# EAGLE board OpenROV Controller 2.6 (EAGLE 6.4)
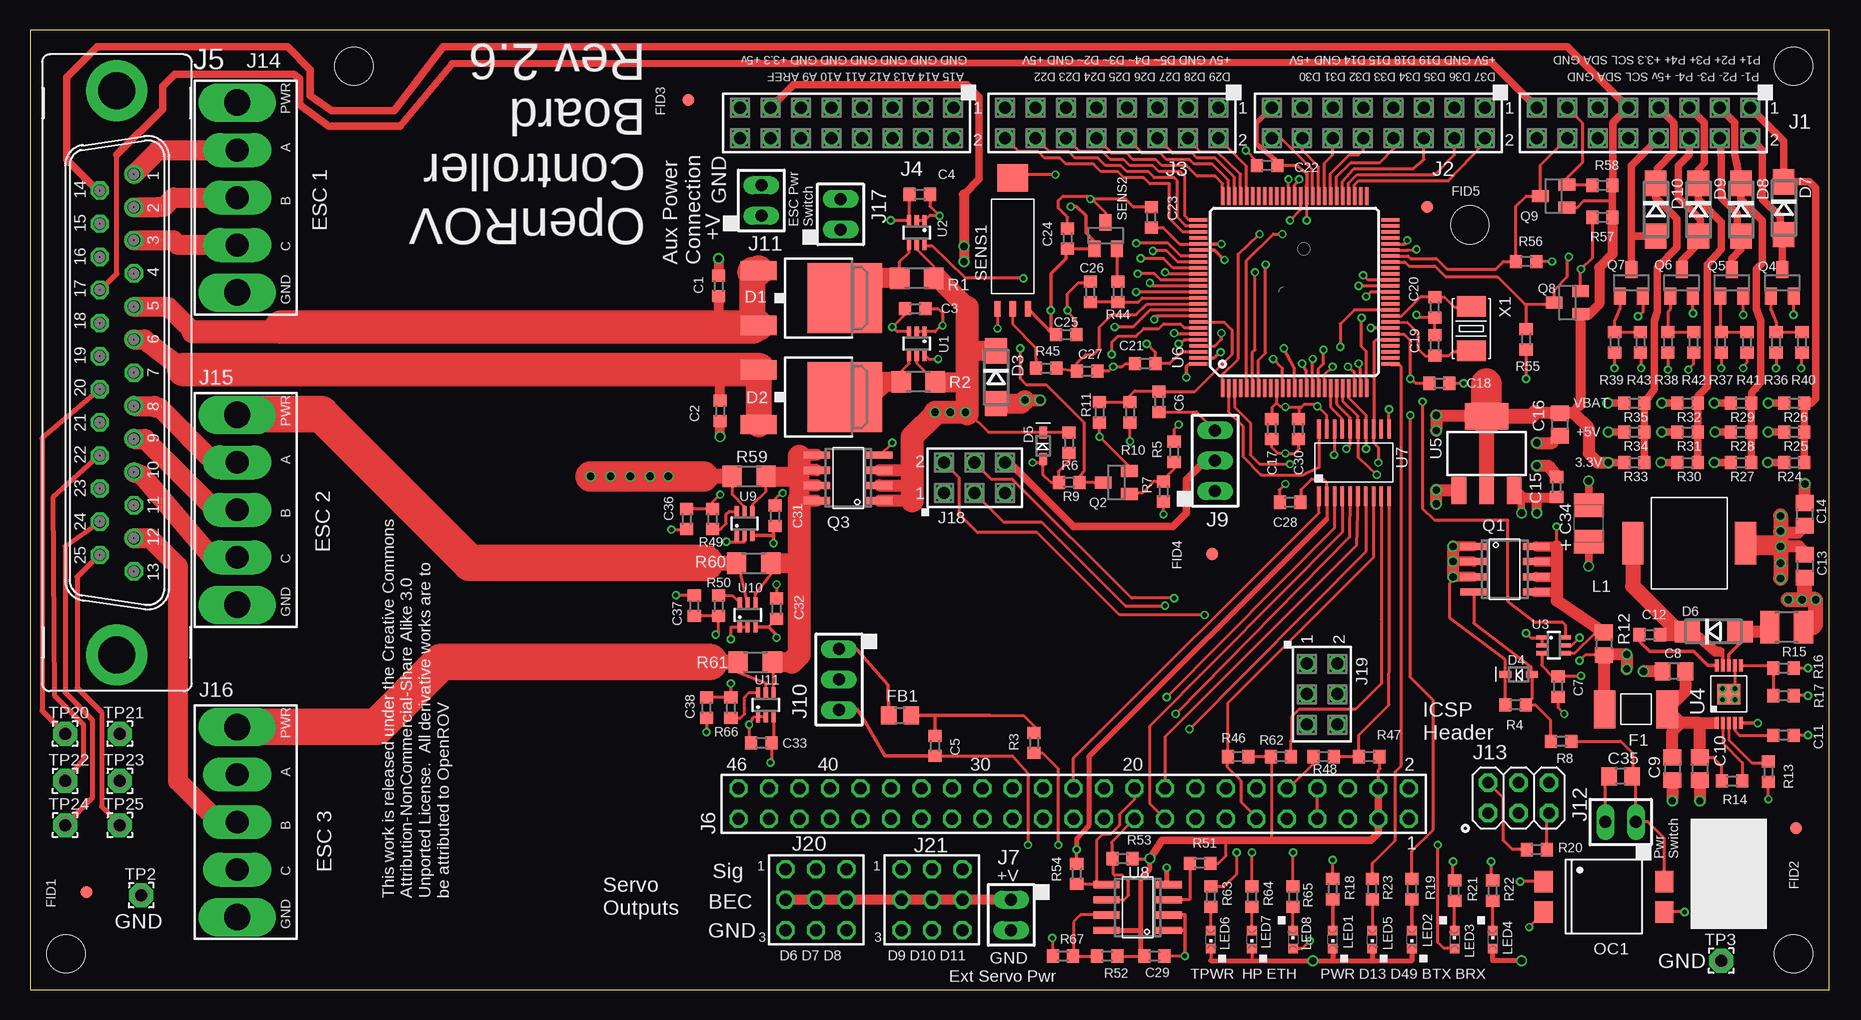
[diagram p8: board, top side]
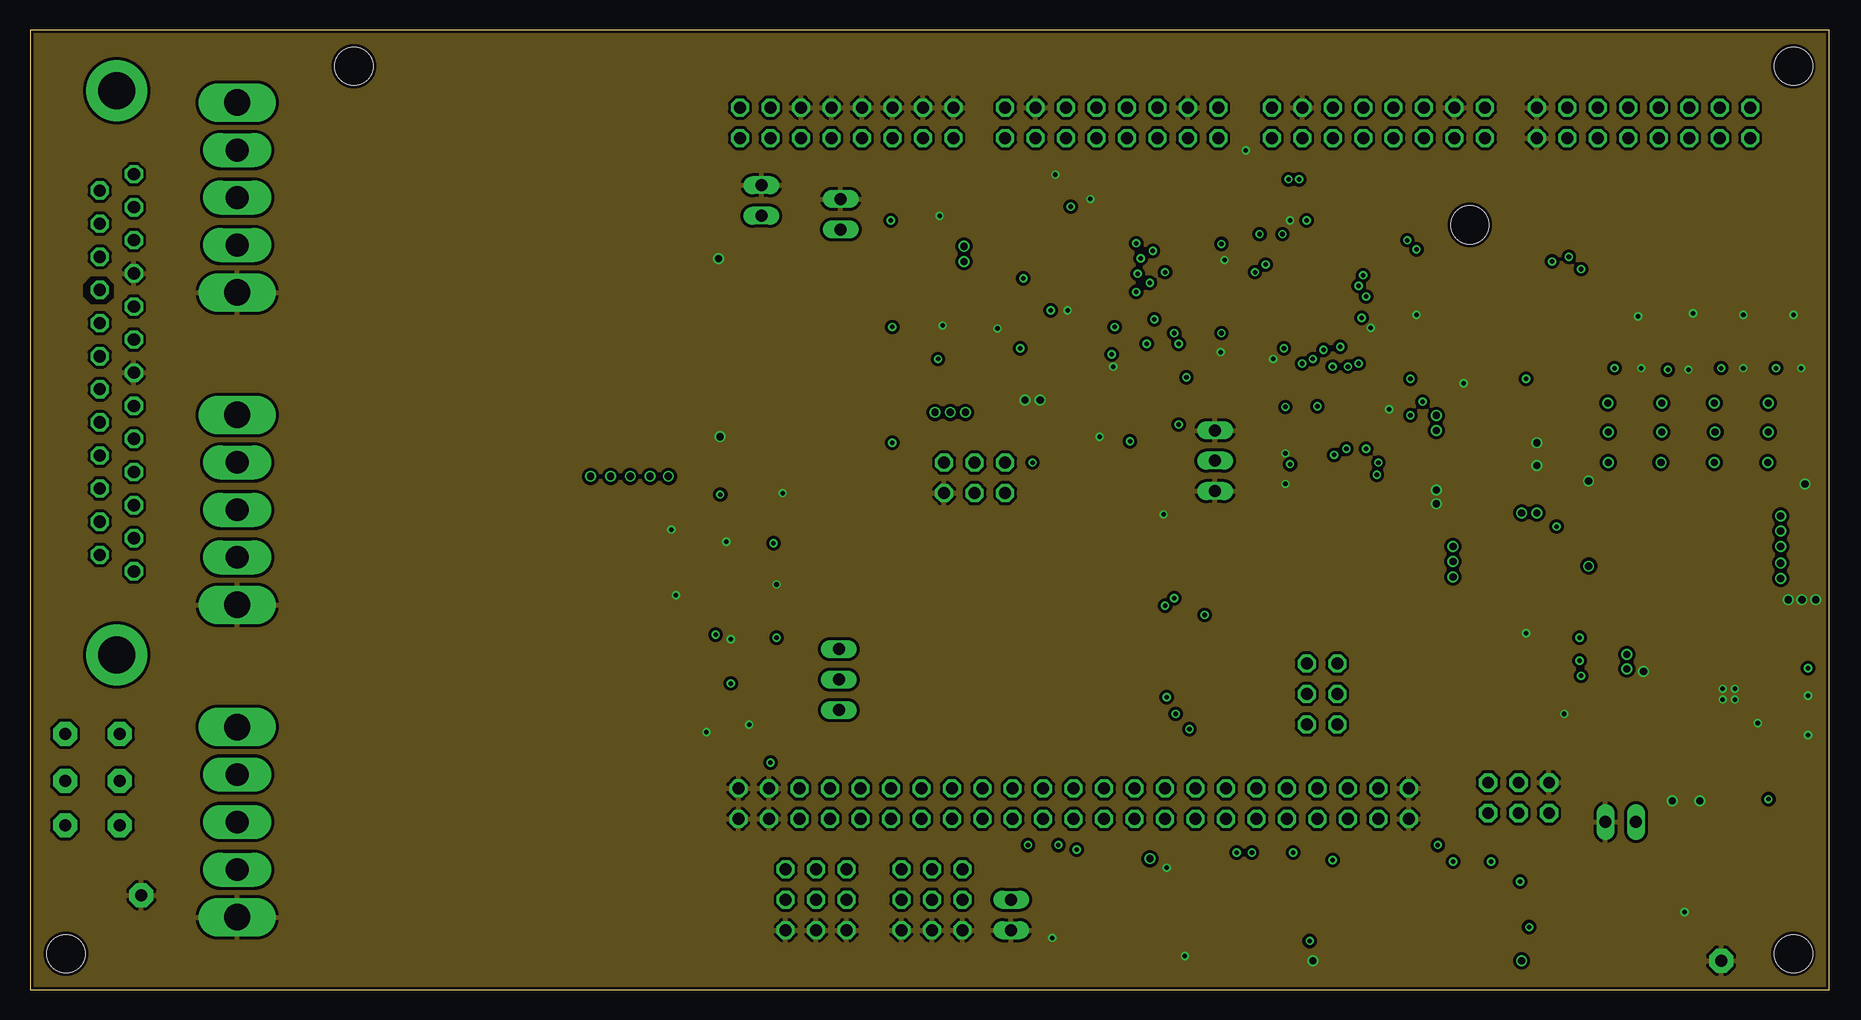
[diagram p9: board, inner layer Route2]
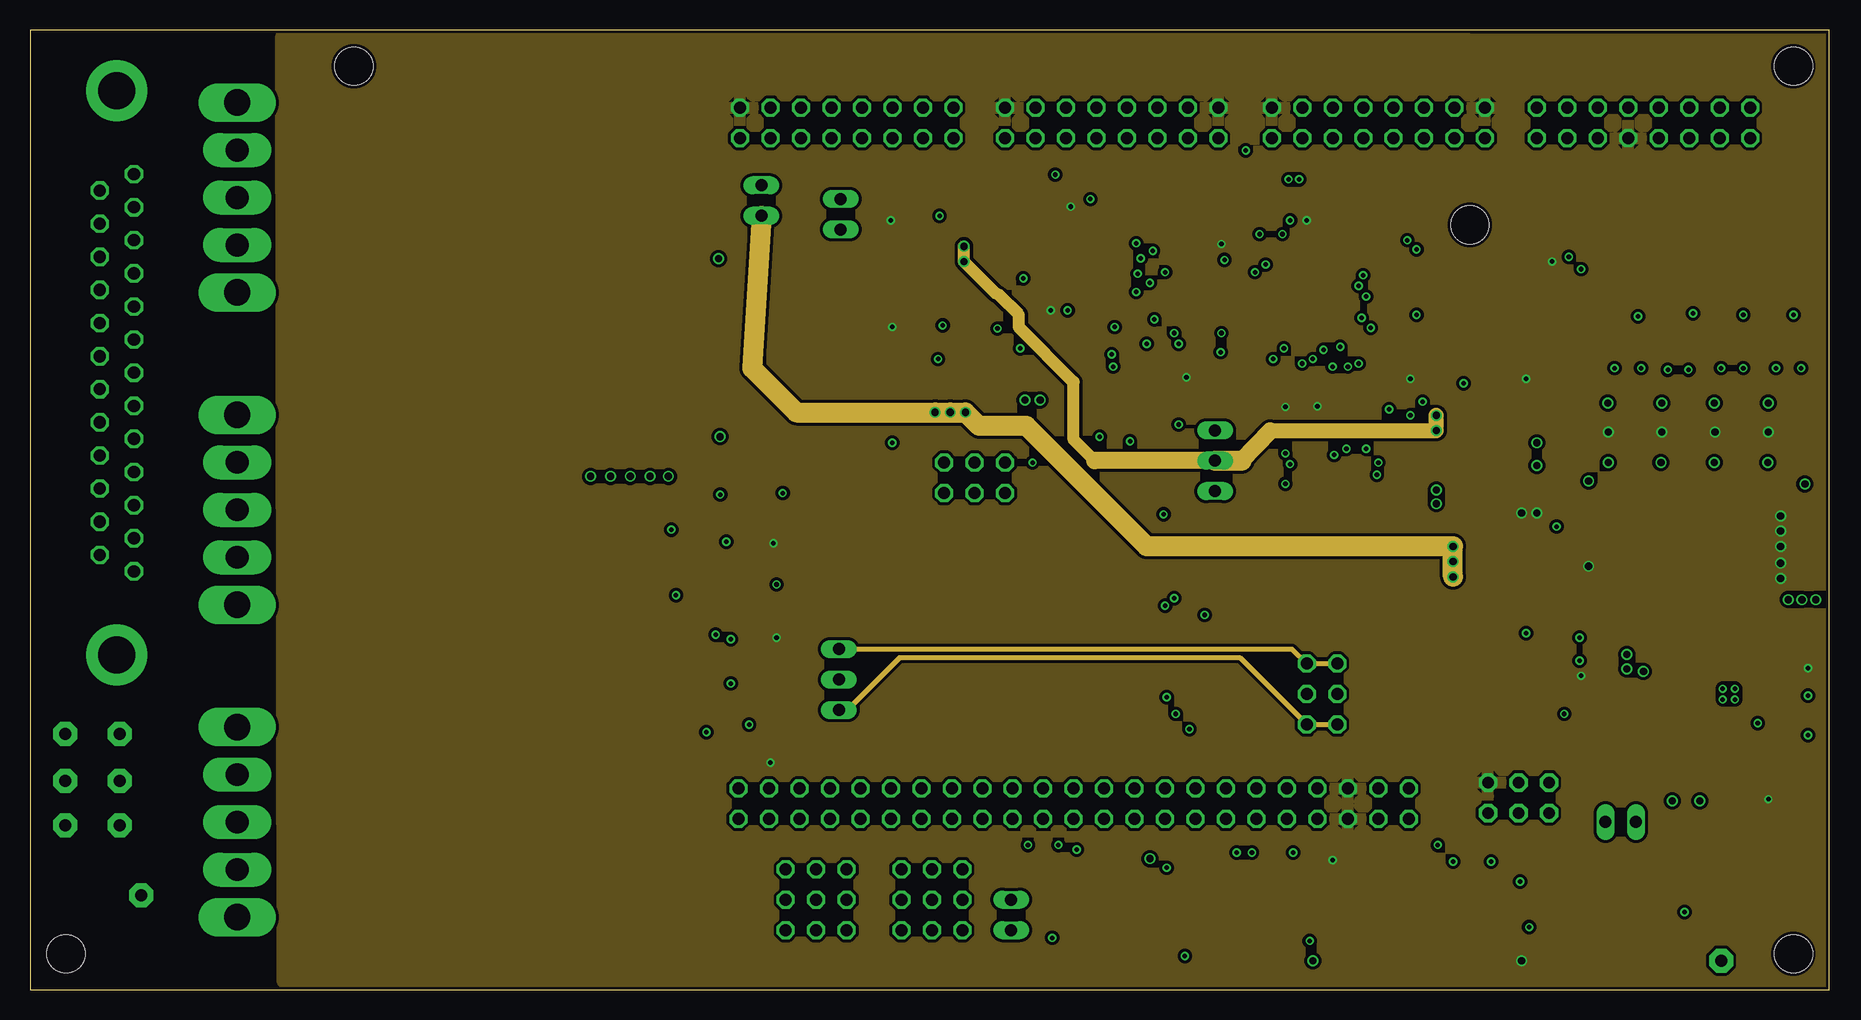
[diagram p10: board, inner layer Route15]
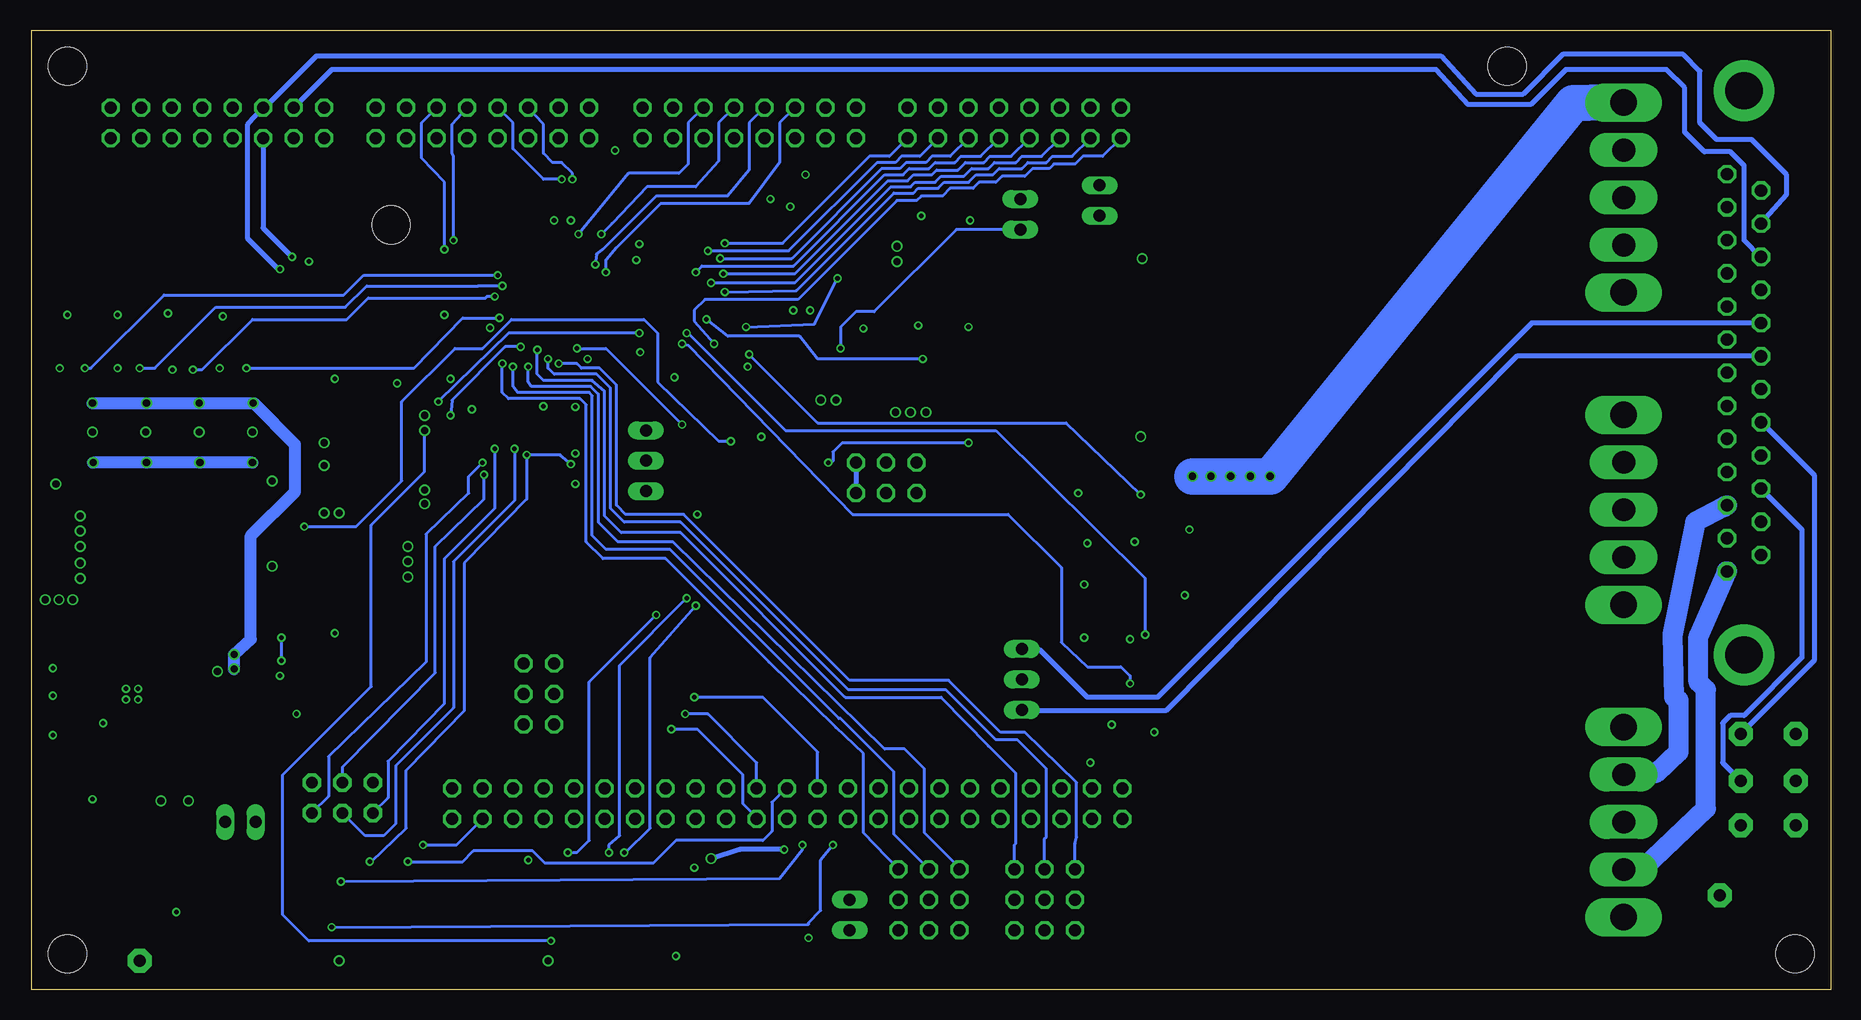
[diagram p11: board, bottom side, seen from below]

Size 149.99 x 80.01 mm. Coordinates in mm from the lower left corner, seen from the top.
Outline: 0,0 149.99,0 149.99,80.01 0,80.01 0,0
Copper layers (1*2+15*16): Top 0.035mm / dielectric 0.2mm / Route2 0.0175mm / dielectric 1.1mm / Route15 0.0175mm / dielectric 0.2mm / Bottom 0.035mm
Design rules "SeeedStudio_DRU_no_angle_20130527 *": minimum track width 6mil, minimum drill 12mil, track to track 6mil, track to pad 6mil, pad to pad 6mil, via to via 6mil, smd to smd 0mil, copper to edge 10mil, drill to drill 10mil, minimum pad ring 6mil, minimum via ring 6mil, stop-mask expansion 2mil, vias tented up to drill 25mil, thermal gap 10mil
Holes 3.17 mm at 3,3 146.99,3 120.02,63.75 146.99,76.99 27,76.99

## Footprints (pad centres in the part's own frame; a part is rotated, then mirrored left to right if it is on the bottom)
R0603 = smd 1 x 1.1: 1 -0.85,0; 2 0.85,0
R0805 = smd 1.3 x 1.5: 1 -0.95,0; 2 0.95,0
KEMET_B-CAPACITOR = smd 1.95 x 2.5: + 1.525,0; - -1.525,0
DPAK = smd 1.6 x 3: 1 -2.28,-4.04; 3 2.28,-4.04 | smd 5.8 x 6.2: 4 0,3.14
DO214AC = smd 2.1 x 1.8: A 2.2,0; C -2.2,0
SOD323 = smd 1 x 0.6: A 1.1,0; C -1.1,0
R1812 = smd 1.78 x 3.15: 1 -2.615,0; 2 2.615,0
FIDUCIAL_1 = smd 1.016 x 1.016: P$1 0,0
SSW-108-02-S-D = drill 1 pad 1.5 octagon: 1 -8.89,-1.27; 2 -8.89,1.27; 3 -6.35,-1.27; 4 -6.35,1.27; 5 -3.81,-1.27; 6 -3.81,1.27; 7 -1.27,-1.27; 8 -1.27,1.27; 9 1.27,-1.27; 10 1.27,1.27; 11 3.81,-1.27; 12 3.81,1.27; 13 6.35,-1.27; 14 6.35,1.27; 15 8.89,-1.27; 16 8.89,1.27
M25VP = drill 1.016 octagon: 1 -16.561,1.422; 2 -13.792,1.422; 3 -11.049,1.422; 4 -8.28,1.422; 5 -5.512,1.422; 6 -2.769,1.422; 7 0,1.422; 8 2.769,1.422; 9 5.512,1.422; 10 8.28,1.422; 11 11.049,1.422; 12 13.792,1.422; 13 16.561,1.422; 14 -15.189,-1.422; 15 -12.421,-1.422; 16 -9.652,-1.422; 17 -6.909,-1.422; 18 -4.14,-1.422; 19 -1.372,-1.422; 20 1.372,-1.422; 21 4.14,-1.422; 22 6.909,-1.422; 23 9.652,-1.422; 24 12.421,-1.422; 25 15.189,-1.422 | drill 3.1 pad 5.08: G1 -23.52,0; G2 23.52,0
TSW-123-02-S-D = drill 1 pad 1.5 octagon: 1 27.94,-1.27; 2 27.94,1.27; 3 25.4,-1.27; 4 25.4,1.27; 5 22.86,-1.27; 6 22.86,1.27; 7 20.32,-1.27; 8 20.32,1.27; 9 17.78,-1.27; 10 17.78,1.27; 11 15.24,-1.27; 12 15.24,1.27; 13 12.7,-1.27; 14 12.7,1.27; 15 10.16,-1.27; 16 10.16,1.27; 17 7.62,-1.27; 18 7.62,1.27; 19 5.08,-1.27; 20 5.08,1.27; 21 2.54,-1.27; 22 2.54,1.27; 23 0,-1.27; 24 0,1.27; 25 -2.54,-1.27; 26 -2.54,1.27; 27 -5.08,-1.27; 28 -5.08,1.27; 29 -7.62,-1.27; 30 -7.62,1.27; 31 -10.16,-1.27; 32 -10.16,1.27; 33 -12.7,-1.27; 34 -12.7,1.27; 35 -15.24,-1.27; 36 -15.24,1.27; 37 -17.78,-1.27; 38 -17.78,1.27; 39 -20.32,-1.27; 40 -20.32,1.27; 41 -22.86,-1.27; 42 -22.86,1.27; 43 -25.4,-1.27; 44 -25.4,1.27; 45 -27.94,-1.27; 46 -27.94,1.27
22-23-2021_ALT_SILK = drill 1 long: 1 -1.27,0; 2 1.27,0
22-23-2031_ALT_SILK = drill 1 long: 1 -2.54,0; 2 0,0; 3 2.54,0
HDR_PINS_2X3 = drill 0.95 pad 1.55 octagon: 1 -2.54,-1.27; 2 -2.54,1.27; 3 0,-1.27; 4 0,1.27; 5 2.54,-1.27; 6 2.54,1.27
ESC-PADS-.156-ALT_SILK = drill 2.2 pad 2.921 long: 1 -7.92,0; 5 7.92,0 | drill 1.9 pad 2.54 long: 2 -3.96,0; 3 0,0; 4 3.96,0
SSW-103-02-S-D = drill 1 pad 1.5 octagon: 1 -2.54,-1.27; 2 -2.54,1.27; 3 0,-1.27; 4 0,1.27; 5 2.54,-1.27; 6 2.54,1.27
HDR_PINS_3X3 = drill 1 pad 1.5 octagon: P1 2.54,-2.54; P2 2.54,0; P3 2.54,2.54; P4 0,-2.54; P5 0,0; P6 0,2.54; P7 -2.54,-2.54; P8 -2.54,0; P9 -2.54,2.54
MSS1048 = smd 3.556 x 1.778: P$1 0,4.699; P$2 0,-4.699
LED_CHIPLED_0603 = smd 0.8 x 0.8: A 0,-0.75; C 0,0.75
DIL4-SMD = smd 1.78 x 1.52: 1 -2.54,-5.029; 2 0,-5.029; 3 0,5.029; 4 -2.54,5.029
SO8 = smd 0.6 x 2.2: 1 -1.905,-2.6; 2 -0.635,-2.6; 3 0.635,-2.6; 4 1.905,-2.6; 5 1.905,2.6; 6 0.635,2.6; 7 -0.635,2.6; 8 -1.905,2.6
SOT23 = smd 1 x 1.4: 1 -0.95,-1.1; 2 0.95,-1.1; 3 0,1.1
R1206 = smd 1.6 x 1.803: 1 -1.422,0; 2 1.422,0
R1210 = smd 1.6 x 2.7: 1 -1.4,0; 2 1.4,0
HIH-5031 = smd 0.508 x 1.27: 1 -1.27,0; 2 0,0; 3 1.27,0 | smd 2.54 x 2.286: PAD 0,10.922
2.0/1.0 = drill 1 pad 2 octagon: 1 0,0
SC70-6L = smd 0.35 x 0.9: 1 -0.65,-1; 2 0,-1; 3 0.65,-1; 4 0.65,1; 5 0,1; 6 -0.65,1
VSSOP-10 = smd 0.3 x 1.02: 1 -1,-2.4; 2 -0.5,-2.4; 3 0,-2.4; 4 0.5,-2.4; 5 1,-2.4; 6 1,2.4; 7 0.5,2.4; 8 0,2.4; 9 -0.5,2.4; 10 -1,2.4 | smd 1.9 x 1.73: 11 0,0
SOT223 = smd 1.219 x 2.235: 1 -2.311,-3.099; 2 0,-3.099; 3 2.311,-3.099 | smd 3.6 x 2.2: 4 0,3.099
SMARTPRJ_TQFP100 = smd 1.5 x 0.3: 1 -8,6; 2 -8,5.5; 3 -8,5; 4 -8,4.5; 5 -8,4; 6 -8,3.5; 7 -8,3; 8 -8,2.5; 9 -8,2; 10 -8,1.5; 11 -8,1; 12 -8,0.5; 13 -8,0; 14 -8,-0.5; 15 -8,-1; 16 -8,-1.5; 17 -8,-2; 18 -8,-2.5; 19 -8,-3; 20 -8,-3.5; 21 -8,-4; 22 -8,-4.5; 23 -8,-5; 24 -8,-5.5; 25 -8,-6; 51 8,-6; 52 8,-5.5; 53 8,-5; 54 8,-4.5; 55 8,-4; 56 8,-3.5; 57 8,-3; 58 8,-2.5; 59 8,-2; 60 8,-1.5; 61 8,-1; 62 8,-0.5; 63 8,0; 64 8,0.5; 65 8,1; 66 8,1.5; 67 8,2; 68 8,2.5; 69 8,3; 70 8,3.5; 71 8,4; 72 8,4.5; 73 8,5; 74 8,5.5; 75 8,6 | smd 0.3 x 1.5: 26 -6,-8; 27 -5.5,-8; 28 -5,-8; 29 -4.5,-8; 30 -4,-8; 31 -3.5,-8; 32 -3,-8; 33 -2.5,-8; 34 -2,-8; 35 -1.5,-8; 36 -1,-8; 37 -0.5,-8; 38 0,-8; 39 0.5,-8; 40 1,-8; 41 1.5,-8; 42 2,-8; 43 2.5,-8; 44 3,-8; 45 3.5,-8; 46 4,-8; 47 4.5,-8; 48 5,-8; 49 5.5,-8; 50 6,-8; 76 6,8; 77 5.5,8; 78 5,8; 79 4.5,8; 80 4,8; 81 3.5,8; 82 3,8; 83 2.5,8; 84 2,8; 85 1.5,8; 86 1,8; 87 0.5,8; 88 0,8; 89 -0.5,8; 90 -1,8; 91 -1.5,8; 92 -2,8; 93 -2.5,8; 94 -3,8; 95 -3.5,8; 96 -4,8; 97 -4.5,8; 98 -5,8; 99 -5.5,8; 100 -6,8
SSOP-20 = smd 0.3 x 1.6: 1 -2.925,-2.8; 2 -2.275,-2.8; 3 -1.625,-2.8; 4 -0.975,-2.8; 5 -0.325,-2.8; 6 0.325,-2.8; 7 0.975,-2.8; 8 1.625,-2.8; 9 2.275,-2.8; 10 2.925,-2.8; 11 2.925,2.8; 12 2.275,2.8; 13 1.625,2.8; 14 0.975,2.8; 15 0.325,2.8; 16 -0.325,2.8; 17 -0.975,2.8; 18 -1.625,2.8; 19 -2.275,2.8; 20 -2.925,2.8
DISCRETE_2P-SMD-5X3.2 = smd 1.7 x 2.4: 1 -1.85,0; 2 1.85,0

## Placement (x,y rotation side)
C1  0.1 uF  [R0603]  57.4,58.67 90 top
C2  0.1 uF  [R0603]  57.53,48.26 270 top
C3  0.1 uF  [R0603]  73.79,56.77 0 top
C4  0.1 uF  [R0603]  74.17,66.29 0 top
C5  0.1 uF  [R0603]  75.44,20.32 270 top
C6  0.1 uF  [R0603]  94.11,49.02 270 top
C7  0.1 uF  [R0603]  127.38,25.27 270 top
C8  1 uF 50V X5R  [R0805]  137.03,26.54 180 top
C9  1 uF 50V X5R  [R0805]  136.91,18.41 270 top
C10  1 uF 50V X5R  [R0805]  139.19,18.41 270 top
C11  1000 pF 50V X7R  [R0603]  146.18,21.21 0 top
C12  0.1 uF  [R0603]  135,29.59 0 top
C13  10 uF 10V X5R  [R0805]  147.96,35.31 270 top
C14  10 uF 10V X5R  [R0805]  147.96,39.62 90 top
C15  0.1 uF  [R0603]  127.25,41.91 90 top
C16  10 uF 10V X5R  [R0805]  127.51,47.12 270 top
C17  0.1 uF  [R0603]  103.5,46.74 270 top
C18  0.1 uF  [R0603]  117.47,50.55 0 top
C19  12 pF  [R0603]  117.09,53.72 90 top
C20  12 pF  [R0603]  117.09,56.9 270 top
C21  0.1 uF  [R0603]  92.96,52.2 180 top
C22  0.1 uF  [R0603]  103.12,68.71 180 top
C23  0.1 uF  [R0603]  93.47,64.39 90 top
C24  0.1 uF  [R0603]  86.49,62.61 90 top
C25  0.1 uF  [R0603]  86.36,54.61 0 top
C26  0.1 uF  [R0603]  88.39,58.17 90 top
C27  0.1 uF  [R0603]  88.14,51.56 0 top
C28  0.1 uF  [R0603]  105.03,40.64 180 top
C29  0.1 uF  [R0603]  93.73,2.79 0 top
C30  0.1 uF  [R0603]  105.73,46.74 270 top
C31  0.1 uF  [R0603]  62.1,39.5 90 top
C32  0.1 uF  [R0603]  62.23,31.75 90 top
C33  0.1 uF  [R0603]  60.96,20.57 180 top
C34  220 uF 6.3V  [KEMET_B-CAPACITOR]  129.92,38.86 270 top
C35  DNP  [R0805]  132.59,17.78 180 top
C36  0.1 uF  [R0603]  54.74,39.24 270 top
C37  0.1 uF  [R0603]  55.37,32 90 top
C38  0.1 uF  [R0603]  56.39,23.5 270 top
D1  MBRD835L  [DPAK]  64.77,57.66 270 top
D2  MBRD835L  [DPAK]  64.77,49.4 270 top
D3  SMAJ22A  [DO214AC]  80.52,51.05 270 top
D4  16.18V 2%  [SOD323]  124.08,26.29 0 top
D5  16.18V 2%  [SOD323]  84.45,45.34 270 top
D6  CDBA340  [DO214AC]  140.34,29.84 0 top
D7  S1A  [DO214AC]  146.18,65.15 270 top
D8  S1A  [DO214AC]  142.62,65.02 270 top
D9  S1A  [DO214AC]  139.06,65.02 270 top
D10  S1A  [DO214AC]  135.51,65.02 270 top
F1  1.95A / 1.1A  [R1812]  133.86,23.37 0 top
FB1  HZ0805B272R-10  [R0805]  72.52,22.86 0 top
FID1  FIDUCIAL_1  [FIDUCIAL_1]  4.7,8.13 0 top
FID2  FIDUCIAL_1  [FIDUCIAL_1]  147.19,13.46 0 top
FID3  FIDUCIAL_1  [FIDUCIAL_1]  54.86,74.17 0 top
FID4  FIDUCIAL_1  [FIDUCIAL_1]  98.55,36.32 0 top
FID5  FIDUCIAL_1  [FIDUCIAL_1]  116.46,65.28 0 top
J1  SSW-108-01-G-D  [SSW-108-02-S-D]  134.49,72.26 180 top
J2  SSW-108-01-G-D  [SSW-108-02-S-D]  112.39,72.26 180 top
J3  SSW-108-01-G-D  [SSW-108-02-S-D]  90.17,72.26 180 top
J4  SSW-108-01-G-D  [SSW-108-02-S-D]  68.07,72.26 180 top
J5  FCI 10090096-P254  [M25VP]  7.24,51.44 270 top
J6  Samtec DW-23-11-G-D-630  [TSW-123-02-S-D]  87,15.49 0 top
J7  [22-23-2021_ALT_SILK]  81.79,6.22 270 top
J9  [22-23-2031_ALT_SILK]  98.78,44.09 90 top
J10  [22-23-2031_ALT_SILK]  67.44,25.86 270 top
J11  [22-23-2021_ALT_SILK]  60.96,65.79 90 top
J12  [22-23-2021_ALT_SILK]  132.59,13.97 180 top
J13  [HDR_PINS_2X3]  124.08,16 0 top
J14  [ESC-PADS-.156-ALT_SILK]  17.27,66.04 270 top
J15  [ESC-PADS-.156-ALT_SILK]  17.27,40.01 270 top
J16  [ESC-PADS-.156-ALT_SILK]  17.27,13.97 270 top
J17  [22-23-2021_ALT_SILK]  67.56,64.64 90 top
J18  SSW-103-01-G-D  [SSW-103-02-S-D]  78.74,42.67 0 top
J19  SSW-103-01-G-D  [SSW-103-02-S-D]  107.7,24.64 270 top
J20  TSW-103-07-G-T  [HDR_PINS_3X3]  65.53,7.49 180 top
J21  TSW-103-07-G-T  [HDR_PINS_3X3]  75.18,7.49 180 top
L1  MSS1048-153MLB  [MSS1048]  138.3,37.21 90 top
LED1  Green  [LED_CHIPLED_0603]  108.58,4.19 180 top
LED2  RED  [LED_CHIPLED_0603]  115.19,4.19 180 top
LED3  YELLOW  [LED_CHIPLED_0603]  118.75,4.19 0 top
LED4  YELLOW  [LED_CHIPLED_0603]  121.92,4.19 0 top
LED5  RED  [LED_CHIPLED_0603]  111.89,4.19 180 top
LED6  Green  [LED_CHIPLED_0603]  98.42,4.19 180 top
LED7  Yellow  [LED_CHIPLED_0603]  101.85,4.19 180 top
LED8  Yellow  [LED_CHIPLED_0603]  105.28,4.19 0 top
OC1  LTV-8141S  [DIL4-SMD]  131.19,6.48 270 top
Q1  SI4485  [SO8]  122.94,35.05 270 top
Q2  DMN65D8L  [SOT23]  90.55,42.29 90 top
Q3  SI4425  [SO8]  68.2,42.67 90 top
Q4  IRLML6346TR  [SOT23]  146.05,58.93 0 top
Q5  IRLML6346TR  [SOT23]  141.86,58.93 0 top
Q6  IRLML6346TR  [SOT23]  137.67,58.93 0 top
Q7  IRLML6346TR  [SOT23]  133.48,58.93 0 top
Q8  FDV301N  [SOT23]  128.14,57.28 90 top
Q9  FDV301N  [SOT23]  127,66.17 90 top
R1  0.005 1%  [R1206]  73.91,59.31 0 top
R2  0.005 1%  [R1206]  74.04,50.67 0 top
R3  18K  [R0603]  83.69,20.57 90 top
R4  10K  [R0603]  123.83,23.75 180 top
R5  1K  [R0603]  95.38,44.83 90 top
R6  10K  [R0603]  86.61,45.59 90 top
R7  10K  [R0603]  94.49,41.53 270 top
R8  1K  [R0603]  127.64,20.7 180 top
R9  1K  [R0603]  86.61,42.29 180 top
R10  30.1K 1%  [R0603]  91.69,48.13 90 top
R11  10.0K 1%  [R0603]  89.15,48.13 270 top
R12  0.025 1%  [R0805]  131.19,28.83 270 top
R13  10K  [R0603]  144.91,18.16 270 top
R14  133K 1%  [R0603]  141.86,17.4 180 top
R15  0.075 1%  [R1210]  146.43,30.23 180 top
R16  9.76K 1%  [R0603]  146.18,26.8 0 top
R17  10.0K 1%  [R0603]  146.18,24.51 180 top
R18  1K  [R0603]  108.58,8.38 270 top
R19  1K  [R0603]  115.19,8.38 270 top
R20  100K  [R0603]  125.6,11.68 0 top
R21  470  [R0603]  118.75,8.26 90 top
R22  1K  [R0603]  121.92,8.26 90 top
R23  1K  [R0603]  111.89,8.38 270 top
R24  DNP  [R0603]  147.07,43.94 0 top
R25  DNP  [R0603]  147.07,46.48 0 top
R26  0 (Jumper)  [R0603]  147.07,48.9 0 top
R27  DNP  [R0603]  142.62,43.94 0 top
R28  0 (Jumper)  [R0603]  142.62,46.48 0 top
R29  DNP  [R0603]  142.62,48.9 0 top
R30  DNP  [R0603]  138.18,43.94 0 top
R31  DNP  [R0603]  138.18,46.48 0 top
R32  DNP  [R0603]  138.18,48.9 0 top
R33  DNP  [R0603]  133.73,43.94 0 top
R34  DNP  [R0603]  133.73,46.48 0 top
R35  DNP  [R0603]  133.73,48.9 0 top
R36  1K  [R0603]  145.54,53.98 90 top
R37  1K  [R0603]  140.97,53.98 90 top
R38  1K  [R0603]  136.53,53.98 90 top
R39  1K  [R0603]  132.08,53.98 90 top
R40  10K  [R0603]  147.7,53.98 90 top
R41  10K  [R0603]  143.13,53.98 90 top
R42  10K  [R0603]  138.68,53.98 90 top
R43  10K  [R0603]  134.24,53.98 90 top
R44  10K  [R0603]  90.68,58.17 270 top
R45  10K  [R0603]  84.71,51.82 0 top
R46  1K  [R0603]  100.71,19.43 0 top
R47  DNP  [R0603]  111.63,19.43 0 top
R48  0 (Jumper)  [R0603]  107.82,19.43 180 top
R49  10K  [R0603]  56.9,39.24 90 top
R50  10K  [R0603]  57.4,32 270 top
R51  4.7K  [R0603]  97.54,10.54 0 top
R52  4.7K  [R0603]  89.79,2.79 0 top
R53  4.7K  [R0603]  91.06,10.92 0 top
R54  4.7K  [R0603]  87.25,9.65 90 top
R55  4.7K  [R0603]  124.71,54.23 270 top
R56  4.7K  [R0603]  124.71,60.71 0 top
R57  4.7K  [R0603]  131.06,64.39 0 top
R58  4.7K  [R0603]  131.06,67.06 0 top
R59  0.005 1%  [R1206]  59.94,42.8 180 top
R60  0.005 1%  [R1206]  60.33,35.56 180 top
R61  0.005 1%  [R1206]  60.45,27.3 180 top
R62  10K  [R0603]  104.27,19.43 180 top
R63  120  [R0603]  98.42,7.75 90 top
R64  120  [R0603]  101.85,7.75 90 top
R65  330  [R0603]  105.28,7.75 90 top
R66  10K  [R0603]  58.42,23.5 90 top
R67  0  [R0603]  86.11,2.79 0 top
SENS1  HIH-5031  [HIH-5031]  81.92,56.77 0 top
SENS2  MCP9701A  [SOT23]  89.66,62.87 0 top
TP2  [2.0/1.0]  9.27,7.87 0 top
TP3  [2.0/1.0]  140.97,2.41 0 top
TP20  [2.0/1.0]  2.92,21.34 0 top
TP21  [2.0/1.0]  7.49,21.34 0 top
TP22  [2.0/1.0]  2.92,17.4 0 top
TP23  [2.0/1.0]  7.49,17.4 0 top
TP24  [2.0/1.0]  2.92,13.72 0 top
TP25  [2.0/1.0]  7.49,13.72 0 top
U1  INA199A2  [SC70-6L]  73.91,53.85 180 top
U2  INA199A2  [SC70-6L]  73.91,63.12 180 top
U3  INA199A2  [SC70-6L]  127,28.7 270 top
U4  LM25011  [VSSOP-10]  141.6,24.64 0 top
U5  TLV1117LV33  [SOT223]  121.41,44.7 0 top
U6  ATMEGA2560-16AU  [SMARTPRJ_TQFP100]  105.41,58.17 90 top
U7  TXB0108SSOP-20  [SSOP-20]  110.36,43.94 0 top
U8  CAT24C256WI-G  [SO8]  92.33,6.86 90 top
U9  INA199A2  [SC70-6L]  59.56,38.86 0 top
U10  INA199A2  [SC70-6L]  59.82,31.24 0 top
U11  INA199A2  [SC70-6L]  61.34,23.75 0 top
X1  16 MHz  [DISCRETE_2P-SMD-5X3.2]  120.14,55.12 270 top

## Tracks (layer width: path | path; a pad name or v marks a point on that pad's centre or on a via)
3V3_SCL  (via drill 0.38)
  Top 0.254: Q8.2 129.24,60.03 v129.29,60.07 130.21,61 R57.1
  Bottom 0.406: v129.29,60.07 129.41,60.07 131.95,62.61 131.95,72.14 J1.11 130.56,73.53 126.24,77.85 32.51,77.85 29.59,74.68 25.65,74.68 22.35,77.98 12.32,77.98 10.92,76.58 10.92,72.26 9.53,70.87 6.6,70.87 3.68,67.94 3.68,66.29 5.82,63.91 J5.15
3V3_SDA
  Top 0.254: J1.13 129.41,72.26 129.41,68.96 128.14,67.69 128.14,67.16 Q9.2 130.15,67.12 R58.1
  Bottom 0.406: J5.16 5.84,61.09 7.24,62.48 7.24,68.71 8.38,69.85 10.54,69.85 12.19,71.5 12.19,75.18 13.72,76.71 22.1,76.71 25.02,73.79 30.23,73.79 32.89,76.71 124.97,76.71 J1.13
+3V3  (via drill 0.38, 0.6)
  Top 0.254: Q9.1 128.97,65.22 129.54,65.79 131.79,65.79 131.91,65.91 | LED8.A 106.06,3.44 v106.68,4.06
  Top 0.61: R57.2 131.91,65.91 R58.2 131.95,67.09 131.95,72.26 J1.9 128.14,78.61 34.42,78.61 30.35,73.28 25.15,73.28 23.37,74.55 23.37,76.71 21.46,78.61 5.59,78.61 3.05,76.07 3.05,69.22 5.64,66.62 J5.14 | 129.92,56.26 129.31,56.26 Q8.1 | R33.1 v131.57,43.94 | R30.1 v135.95,43.94 | R27.1 v140.4,43.94 | R24.1 v144.84,43.94 | 121.36,47.75 U5.4 | J4.13 63.63,75.44 78.11,75.44 79.12,74.42 79.12,67.56 77.85,66.29 | J18.6 81.66,43.94 87,38.61 95.25,38.61 96.39,39.75 96.39,42.55 97.92,44.07 98.75,44.07 J9.2
  Top 0.813: R57.2 131.91,61.3 130.81,60.2 130.81,57.15 129.92,56.26 | Q8.1 129.24,48.73 128.65,48.13 | 77.85,66.29 v77.85,61.98 v77.85,60.71
  Top 1.016: 125.48,48.13 127.44,48.13 | 127.44,48.13 C16.1 | 127.44,48.13 128.65,48.13 129.92,46.86 129.92,44.7 130.68,43.94 v131.57,43.94 | U5.4 121.34,47.88 v117.22,47.88 v117.22,46.61
  Top 1.27: 125.48,48.13 125.15,47.8 U5.4 121.41,47.5 U5.2
  Top 2.54: 121.41,47.5 121.41,50.55
  Route15 1.016: 88.75,44.09 87,45.85 87,50.67 82.42,55.24 82.42,56.26 80.77,57.91 80.52,58.04 v77.85,60.71 v77.85,61.98
  Route15 1.27: 103.38,46.61 v117.22,46.61 v117.22,47.88
  Route15 1.422: 100.99,44.09 103.38,46.61 | J9.2 88.75,44.09
  Route15 1.676: J9.2 100.99,44.09
  Bottom 0.254: v106.68,4.06 126.87,4.06 129.03,6.22 129.03,17.91 121.67,25.27 121.67,38.73 117.22,43.18 v117.22,46.61
  Bottom 0.406: J18.6 J18.5
  Bottom 1.016: v131.57,43.94 v135.95,43.94 v140.4,43.94 v144.84,43.94
+5V  (via drill 0.38, 0.6)
  Top 0.254: 61.57,30.24 C32.1 | U11.3 61.99,20.77 C33.1 61.85,20.54 61.85,19.18 61.72,19.05 v61.72,18.92 | 61.95,37.86 C31.1 | 106.41,68.09 105.66,68.71 C22.1 | C18.1 115.57,50.55 v115.06,50.93 115.06,54.1 114.55,54.61 113.47,54.61 U6.31 | C24.1 SENS2.1 | C23.1 94.45,63.54 95.82,62.17 97.28,62.17 U6.80 | U6.10 103.91,48.92 | 103.91,48.92 103.5,48.51 C17.1 | U7.19 108.09,47.87 v107.31,48.64 107.19,48.77 106.17,48.77 105.92,48.51 | 105.92,48.51 105.79,48.39 C30.1 | U3.3 126,27.04 126.87,26.16 127.34,26.16 | 127.34,26.16 C7.1 | R18.1 v108.58,10.79 | 127.34,26.16 v129.29,26.16 | v148.21,26.8 R16.2 | 103.91,48.92 104.25,48.58 v104.65,48.58 105.86,48.58 105.92,48.51 | v126.87,60.71 R56.2 | v124.71,50.93 R55.2 | U6.61 106.43,68.07 106.41,64.15 v106.43,64.14 | v144.91,15.88 R13.2 | R20.1 123.57,11.68 122.81,12.45 122.81,16 J13.2 | C4.1 73.32,64.12 U2.3 71.75,64.12 v71.75,64.14 | U1.3 72.28,54.85 v71.88,55.24 72.94,56.3 C3.1
  Top 0.305: U10.3 61.57,30.24 62.23,29.58 v62.23,29.34 | U9.3 61.95,37.86 | v61.98,37.21 61.98,38.52 C31.1 | SENS2.1 88.71,62.42 88.01,63.12 88.01,64.52 87.25,65.28 v86.74,65.28 | C24.1 86.36,61.63 86.36,60.96 85.09,59.69 v85.09,56.64 85.09,55.03 C25.1 85.38,54.48 SENS1.3 | U6.80 v99.31,62.17 | v99.31,62.17 | U6.100 96.62,52.17 96.39,51.94 v96.39,51.05
  Top 0.406: C22.1 103.85,69.13 102.23,70.48 102.23,72.26 J2.15 | v124.33,2.41 121.92,2.41 LED4.A
  Top 0.61: R25.1 v144.91,46.48 | R28.1 v140.46,46.48 140.34,46.48 | R31.1 v136.02,46.48 | R34.1 v131.57,46.48 | 143.13,37.08 L1.P$2 | 146.05,38.1 v145.92,38.23 | 146.18,37.21 v145.92,36.96 | v129.92,35.31 C34.+ | v124.33,39.75 124.33,41.02
  Top 0.813: U5.3 123.88,41.6 124.46,41.02 125.6,41.02 | 125.6,41.02 127.32,41.02 C15.1 | v125.6,39.75 125.6,41.02
  Top 1.016: 146.05,38.1 147.38,38.1 C14.1 | C13.1 147.96,36.45 147.45,36.96 v145.92,36.96
  Top 1.27: v145.92,39.5 v145.92,38.23 v145.92,36.96 v145.92,34.29
  Top 1.676: 143.13,37.08 145.8,37.08 v145.92,36.96
  other vias: 145.92,35.56
  pour Route15 (isolate 0.254): 60.83,79.38 149.61,79.25 149.61,0 21.08,0.64 20.95,79.5
ADC0  (via drill 0.38)
  Top 0.254: v116.08,49.02 116.08,40.13 117.09,39.12 123.19,39.12 123.19,32.38 125.48,30.61 127.76,30.61 128,30.37 U3.6 | U6.97 98.75,53.67 99.31,54.23 v99.31,54.74
  Bottom 0.254: v99.31,54.74 110.24,54.74 v116.08,49.02
ADC1  (via drill 0.38)
  Top 0.254: U6.96 96.2,54.17 v95.76,53.85 | C38.1 R66.2 v58.42,25.53
  Bottom 0.254: v95.76,53.85 95.25,53.72 81.53,39.62 68.58,39.62 64.14,35.18 64.14,28.96 61.98,26.92 59.18,26.92 58.42,26.16 v58.42,25.53
ADC2  (via drill 0.38)
  Top 0.254: U6.95 95.56,54.67 v95.38,54.74 | C37.1 R50.2 57.4,29.84 v57.15,29.59
  Bottom 0.254: v57.15,29.59 57.15,34.29 69.6,46.61 87.12,46.61 95.12,54.61 v95.38,54.74
ADC3  (via drill 0.38)
  Top 0.254: v90.17,52.96 90.17,53.98 90.68,54.48 92.2,54.48 92.84,55.12 94.11,55.12 94.49,55.5 95.89,55.5 96.22,55.17 U6.94 | v57.53,41.27 56.9,40.64 R49.2 C36.1
  Bottom 0.254: v57.53,41.27 63.75,47.24 84.45,47.24 v90.17,52.96
ADC4
  Top 0.254: R11.1 R10.2 91.69,49.53 92.08,49.91 94.07,49.91 C6.1 97.12,49.87 100.2,52.96 100.2,54.99 99.57,55.63 97.45,55.63 U6.93
ADC5  (via drill 0.38)
  Top 0.254: U6.92 93.89,56.17 v93.73,55.88 | U1.6 74.66,52.85 74.93,52.58 v75.69,52.58
  Bottom 0.254: v75.69,52.58 84.45,52.58 85.98,54.48 91.95,54.48 v93.73,55.88
ADC6  (via drill 0.38)
  Top 0.254: U6.91 93.37,56.67 91.95,55.24 v90.42,55.24 | v82.8,59.31 77.98,59.31 75.25,61.98 74.61,62.01 U2.6
  Bottom 0.254: v90.42,55.24 84.71,55.5 v82.8,59.31
ADC7
  Top 0.254: R45.2 C27.1 87.29,52.24 88.01,52.96 88.65,52.96 89.15,53.47 89.15,55.24 90.17,56.26 92.2,56.26 93.09,57.15 97.39,57.15 U6.90
ADC8
  Top 0.254: C26.1 R44.2 92.37,57.32 92.71,57.66 97.4,57.66 U6.89
ADC9  (via drill 0.38)
  Top 0.254: U6.88 v92.2,58.17
  Bottom 0.254: v92.2,58.17 86.23,58.29 78.11,66.42 76.45,66.42 76.07,66.8 74.42,66.8 73.91,67.31 71.88,67.31 71.25,67.94 69.85,67.94 69.34,68.45 67.44,68.45 66.93,68.96 65.41,68.96 64.9,69.47 63.25,69.47 J4.14
ADC10  (via drill 0.38)
  Top 0.254: U6.87 93.61,58.67 v93.34,58.93
  Bottom 0.254: v93.34,58.93 86.36,58.93 78.36,66.93 76.71,66.93 76.33,67.31 74.68,67.31 74.17,67.82 72.26,67.82 71.63,68.45 70.23,68.45 69.72,68.96 67.94,68.96 67.44,69.47 65.79,69.47 J4.12
ADC11  (via drill 0.38)
  Top 0.254: U6.86 94.25,59.17 93.73,59.69 v92.33,59.69
  Bottom 0.254: v92.33,59.69 86.36,59.69 78.61,67.44 76.96,67.44 76.45,67.94 74.93,67.94 74.55,68.33 72.77,68.33 72.14,68.96 70.61,68.96 70.1,69.47 68.33,69.47 J4.10
ADC12  (via drill 0.38)
  Top 0.254: U6.85 94.77,59.67 v94.61,59.82
  Bottom 0.254: v94.61,59.82 94.11,60.33 86.49,60.33 78.87,67.94 77.34,67.94 76.83,68.45 75.18,68.45 74.68,68.96 73.03,68.96 72.52,69.47 70.87,69.47 J4.8
ADC13  (via drill 0.38)
  Top 0.254: U6.84 95.28,60.17 94.49,60.96 v92.58,60.96
  Bottom 0.254: v92.58,60.96 86.61,60.96 79.12,68.45 77.6,68.45 77.09,68.96 75.44,68.96 74.93,69.47 73.41,69.47 J4.6
ADC14  (via drill 0.38)
  Top 0.254: U6.83 95.67,60.67 94.74,61.59 v93.6,61.59
  Bottom 0.254: v93.6,61.59 86.87,61.59 79.5,68.96 77.98,68.96 77.47,69.47 75.95,69.47 J4.4
ADC15  (via drill 0.38)
  Top 0.254: U6.82 95.93,61.17 94.87,62.23 v92.2,62.23
  Bottom 0.254: v92.2,62.23 87.38,62.23 80.14,69.47 78.49,69.47 J4.2
AREF  (via drill 0.38)
  Top 0.254: U6.98 95.97,53.17 95,52.2 C21.1 93.81,53.12 v93.09,53.85
  Bottom 0.254: J4.16 60.71,69.47 62.36,69.47 62.99,68.83 64.77,68.83 65.15,68.45 66.55,68.45 67.18,67.82 69.09,67.82 69.6,67.31 70.99,67.31 71.5,66.8 73.41,66.8 74.04,66.17 75.82,66.17 76.2,65.79 77.85,65.79 86.11,57.53 93.85,57.53 94.74,56.64 94.74,55.75 v93.09,53.85
BAT_1+
  Top 0.813: C1.1 57.4,55.24 57.41,55.24
  Top 1.676: J5.5 11.51,56.95 13.59,54.86 | 20.45,54.86 20.7,55.12 20.95,55.24
  Top 1.93: 13.59,54.86 20.45,54.86
  Top 2.184: 60.22,55.24 60.22,59.8
  Top 2.54: 60.22,55.24 D1.3 | 60.22,59.8 D1.1
  Top 2.794: 20.95,55.24 57.41,55.24 60.22,55.24
BAT_1-1  (via drill 0.38)
  Top 0.254: U3.4 128.76,28.05 130.43,29.72 131.13,29.72 R12.1 | 127.25,36.96 v127.25,38.61 | v91.69,45.72 R10.1
  Top 0.813: Q1.8 127.25,36.96 | Q1.7 127.25,35.69 | Q1.6 127.25,34.42 | 125.48,33.15 Q1.5 127.25,33.15
  Top 1.016: 127.25,36.96 127.25,35.69 127.25,34.42 127.25,33.15 127.25,32.45 R12.1
  Bottom 0.254: v127.25,38.61 122.94,38.61 119.13,42.42 119.13,49.02 114.68,53.47 112.39,53.47 109.98,55.88 98.93,55.88 97.79,54.74 97.79,50.67 92.71,45.72 v91.69,45.72
BAT_2+
  Top 0.813: C2.1 57.53,51.69
  Top 1.676: J5.6 9.55,54.2 12.83,51.69
  Top 2.184: D2.1 D2.3
  Top 2.54: D2.1
  Top 2.794: 12.83,51.69 57.53,51.69 D2.1
BB_3V3  (via drill 0.38, 0.6)
  Top 0.254: 108.09,39.25 U7.2 108.09,42.28 107.82,42.55 106.81,42.55 105.92,41.66 105.92,40.68 C28.1 | 97.28,12.45 99.83,12.4 | 99.83,12.4 101.34,12.37 103.5,12.38 | 103.5,12.38 111.51,12.45 | 103.5,12.38 103.5,19.26 R62.2 R46.2 | J6.4 112.39,18.29 112.52,18.41 112.52,19.39 R47.2 | R53.2 v93.34,10.92 | LED3.A 117.87,3.44 117.86,3.43 117.35,3.94 v117.35,12.06 | R51.2 99.06,10.54 99.69,11.18 99.69,12.26 99.83,12.4 | R52.2 C29.1
  Top 0.305: R54.2 v87.25,11.68 | 92.84,2.75 C29.1 | 97.28,12.37 97.24,12.41
  Top 0.406: 108.09,39.25 88.27,19.43 88.27,13.72 87.25,12.57 v87.25,11.68 | v93.34,10.92 93.34,10.03 92.58,9.27 92.58,4.95 | 92.58,4.95 92.58,3.09 C29.1 | U8.8 92.58,4.95
  Top 0.61: J6.4 J6.3 112.39,13.08 111.76,12.45 111.51,12.45 97.28,12.45 | 97.28,12.45 94.36,12.45 v93.34,10.92 | 97.24,12.41 97.28,12.45
  Bottom 0.254: v117.35,12.06 114.55,12.06 J6.3
  Bottom 0.406: v87.25,11.68 90.93,11.68 v93.34,10.92
BB_P9_11
  Top 0.254: U7.8 111.99,36.04 99.82,23.88 99.82,19.47 R46.1 99.82,19.39 99.82,18.54 100.97,17.4 100.97,15.62 102.23,14.35 J6.11
BB_P9_17
  Top 0.254: J6.17 93.34,15.49 93.34,21.97 109.41,38.16 109.41,41.12 U7.4
BB_P9_18
  Top 0.254: U7.6 110.56,37.03 94.61,21.08 J6.18
BB_P9_19
  Top 0.254: J6.19 90.17,12.32 90.17,12.19 90.21,12.15 R53.1 90.3,10.83 90.3,9.65 90.42,9.53 91.06,9.53 91.57,9.02 91.57,7.87 91.19,7.49 U8.6
BB_P9_20
  Top 0.254: J6.20 92.08,15.88 90.81,14.61 90.81,13.72 90.04,12.95 89.41,12.95 88.9,12.45 88.9,8.96 U8.5 89.06,8.8 R54.1
BB_P9_21  (via drill 0.38)
  Top 0.254: v96.65,21.72 111.38,36.58 111.38,41.1 U7.7
  Bottom 0.254: J6.21 89.53,14.35 90.68,15.49 90.68,17.91 94.49,21.72 v96.65,21.72
BB_P9_22  (via drill 0.38)
  Top 0.254: U7.5 109.98,37.72 v95.5,22.99
  Bottom 0.254: J6.22 89.53,18.92 93.6,22.99 v95.5,22.99
BB_P9_24  (via drill 0.38)
  Top 0.254: J6.24 87,19.3 107.44,39.75 U7.1 | R21.2 118.62,9.11 v118.62,10.67
  Bottom 0.254: v118.62,10.67 114.05,10.67 113.16,11.56 108.2,11.56 107.19,10.54 98.17,10.54 96.27,12.45 89.03,12.45 88.27,13.21 88.27,15.62 87.12,16.76 J6.24
BB_P9_26  (via drill 0.38)
  Top 0.254: U7.3 108.71,41.12 108.71,38.48 v94.74,24.38
  Bottom 0.254: J6.26 84.45,19.81 89.03,24.38 v94.74,24.38
BB_SYS_5V
  Top 0.254: J6.7 J6.8
BB_SYS_RESET*
  Top 0.254: J6.10 104.9,16.76 106.93,18.8 106.93,19.39 R48.2
D0/UART_RX
  Top 0.254: U7.20 107.44,44.58 107.44,43.56 106.05,42.93 102.62,42.93 101.09,44.45 101.09,46.99 99.91,48.17 U6.2
D1/UART_TX  (via drill 0.38)
  Top 0.254: U7.18 108.74,44.6 v108.71,44.58 | U6.3 100.41,48.56 101.73,47.24 101.73,44.58 102.49,43.81 v105.03,43.81 | R22.2 121.79,9.11 v121.79,10.67
  Bottom 0.254: v121.79,10.67 121.67,10.67 118.75,13.46 118.75,18.29 113.92,23.24 113.92,35.56 108.71,40.89 v108.71,44.58 105.92,44.58 v105.03,43.81
D2  (via drill 0.38)
  Top 0.254: U6.6 101.91,53.16 102.11,53.34 v102.11,59.82
  Bottom 0.254: v102.11,59.82 102.11,60.83 101.22,61.85 97.54,65.53 90.17,65.53 87.63,68.96 87.63,72.26 J3.11
D3  (via drill 0.38)
  Top 0.254: U6.7 102.41,52.5 103,53.09 v103,60.45
  Bottom 0.254: J3.9 90.17,72.26 90.17,68.33 91.95,66.17 97.92,66.17 102.39,61.7 102.89,61.32 v103,60.45
D4  (via drill 0.38)
  Top 0.254: v102.49,62.99 100.71,61.34 100.71,52.58 99.41,51.28 U6.1
  Bottom 0.254: J3.7 92.71,72.26 92.71,69.09 94.61,66.93 98.68,66.93 101.6,63.88 v102.49,62.99
D5  (via drill 0.38)
  Top 0.254: U6.5 101.41,51.75 101.41,60.77 103.63,62.99 v104.39,62.99
  Bottom 0.254: J3.5 95.25,72.26 95.25,68.83 96.01,68.07 100.2,68.07 v104.39,62.99
D6  (via drill 0.38)
  Top 0.254: U6.15 106.41,51.58 v106.05,52.2
  Bottom 0.254: v106.05,52.2 104.52,52.2 104.14,51.82 102.62,51.82 101.22,50.42 101.22,40.39 100.46,39.62 95.63,39.62 81.79,25.78 73.53,25.78 69.22,21.46 67.18,21.46 62.87,17.27 62.87,12.7 62.99,12.19 J20.P1
D7  (via drill 0.38)
  Top 0.254: U6.16 106.91,52.55 v106.93,52.58
  Bottom 0.254: v106.93,52.58 106.93,51.82 106.43,51.31 102.87,51.31 101.73,50.16 101.73,40.13 100.58,38.99 95.89,38.99 81.92,25.02 73.79,25.02 69.6,20.83 67.82,20.83 65.41,18.41 65.41,12.7 65.53,12.57 J20.P4
D8  (via drill 0.38)
  Top 0.254: U6.17 107.41,51.78 107.82,52.2 v107.82,53.34
  Bottom 0.254: v107.82,53.34 107.82,51.31 107.31,50.8 103.25,50.8 102.23,49.91 102.23,39.5 100.84,38.1 95.89,38.1 82.17,24.38 74.17,24.38 70.23,20.32 67.94,18.03 67.94,12.19 68.07,12.06 J20.P7
D9  (via drill 0.38)
  Top 0.254: U6.18 107.91,51.27 v108.58,51.94
  Bottom 0.254: v108.58,51.94 108.58,50.67 108.33,50.29 103.38,50.29 102.74,49.66 102.74,38.99 101.09,37.34 96.52,37.34 78.87,20.07 77.22,20.07 75.56,18.41 75.56,13.08 72.64,10.16 J21.P1
D10  (via drill 0.38)
  Top 0.254: U6.23 110.41,51.48 v109.86,51.94
  Bottom 0.254: v109.86,51.94 109.86,50.29 109.47,49.78 103.5,49.78 103.25,49.53 103.25,37.85 102.11,36.7 96.77,36.7 82.68,22.61 82.55,22.61 78.11,18.16 78.11,12.95 J21.P4
D11  (via drill 0.38)
  Top 0.254: U6.24 110.91,51.73 v110.74,52.2
  Bottom 0.254: v110.74,52.2 110.74,49.78 110.24,49.28 104.27,49.28 103.76,48.77 103.76,37.34 102.36,35.94 97.16,35.94 88.52,27.3 82.93,21.84 80.64,19.68 80.64,13.08 J21.P7
D12  (via drill 0.38)
  Top 0.254: R39.1 v132.08,51.82 | U6.25 111.41,53.18 111,53.59 v111,56.01
  Bottom 0.254: v132.08,51.82 118.11,51.82 114.05,56.01 v111,56.01
D13
  Top 0.254: R23.1 111.89,10.54 113.79,12.45 113.79,18.16 114.3,18.67 114.3,51.94 114.17,52.07 113.51,52.07 U6.26
D14  (via drill 0.38)
  Top 0.254: U6.64 v104.91,67.56 v104.9,67.56
  Bottom 0.254: v104.9,67.56 104.9,68.07 105.79,68.96 106.55,68.96 107.31,69.72 107.31,72.14 J2.11
D15  (via drill 0.38)
  Top 0.254: U6.63 105.41,67.06 v105.79,67.56
  Bottom 0.254: v105.79,67.56 107.31,67.56 109.86,70.1 109.86,72.26 J2.9
D16/ESC_POWER_SWITCH  (via drill 0.38)
  Top 0.254: U6.13 105.41,51.82 v104.52,53.47 | R5.2 95.38,46.74 v95.76,47.12
  Bottom 0.254: v104.52,53.47 102.11,53.47 v95.76,47.12
D18  (via drill 0.38)
  Top 0.254: U6.46 114.62,62.17 v114.81,62.48
  Bottom 0.254: v114.81,62.48 114.81,69.47 114.94,69.72 114.94,72.14 J2.7
D19  (via drill 0.38)
  Top 0.254: U6.45 114.88,61.67 v115.57,61.72
  Bottom 0.254: v115.57,61.72 115.57,67.31 117.47,69.34 117.47,72.26 J2.5
D20/5V_SDA
  Top 0.254: U6.44 114.86,61.17 115.06,60.96 117.22,60.96 118.11,60.07 122.17,60.07 122.81,60.71 R56.1 123.86,65.32 124.71,66.17 Q9.3 125.9,68.75 J1.14
D21/5V_SCL  (via drill 0.38)
  Top 0.254: U6.43 114.59,60.67 114.94,60.33 117.09,60.33 117.98,59.44 122.3,59.44 124.59,57.15 124.71,57.15 | 124.71,57.15 126.92,57.15 Q8.3 127.04,58.34 128.14,59.44 128.14,60.96 v128.27,61.09 | R55.1 124.71,57.15
  Bottom 0.406: J1.12 130.68,63.5 v128.27,61.09
D22
  Top 0.254: U6.78 96.09,63.17 95,64.26 95,67.18 93.34,67.18 92.84,67.69 91.19,67.69 90.68,68.2 89.28,68.2 88.65,68.83 86.36,68.83 85.85,69.34 84.58,69.34 84.07,69.85 82.3,69.85 82.3,69.98 J3.16
D23
  Top 0.254: U6.77 96.35,63.67 95.63,64.39 95.63,67.44 95.38,67.69 93.73,67.69 93.22,68.2 91.44,68.2 90.93,68.71 89.66,68.71 89.03,69.34 87.12,69.34 86.61,69.85 84.96,69.85 J3.14
D24
  Top 0.254: U6.76 96.62,64.17 96.27,64.52 96.27,67.82 95.89,68.2 94.11,68.2 93.6,68.71 91.69,68.71 91.19,69.22 90.04,69.22 89.41,69.85 87.5,69.85 J3.12
D25
  Top 0.254: U6.75 99.41,67.21 98.81,67.82 97.28,67.82 96.39,68.71 94.36,68.71 93.85,69.22 91.95,69.22 91.44,69.72 90.17,69.72 J3.10
D26
  Top 0.254: U6.74 99.91,67.48 98.55,68.83 97.03,68.83 96.65,69.22 94.74,69.22 94.23,69.72 92.71,69.72 J3.8
D27
  Top 0.254: U6.73 100.41,67.74 98.81,69.34 97.28,69.34 96.9,69.72 95.25,69.72 J3.6
D28
  Top 0.254: U6.72 100.91,68 98.93,69.85 97.54,69.85 J3.4
D29
  Top 0.254: U6.71 101.41,68.64 J3.2
D30
  Top 0.254: U6.60 106.91,68.35 104.27,70.99 J2.16
D31
  Top 0.254: U6.59 107.41,68.61 106.05,69.98 J2.14
D32
  Top 0.254: U6.58 107.91,68.92 108.58,69.6 J2.12
D33
  Top 0.254: U6.57 108.41,68.02 109.98,69.6 110.74,69.6 111.12,69.98 J2.10
D34
  Top 0.254: U6.56 108.91,67.76 110.11,68.96 112.52,68.96 113.67,70.1 J2.8
D35
  Top 0.254: U6.55 109.41,67.37 110.36,68.45 115.32,68.45 116.2,69.22 J2.6
D36
  Top 0.254: U6.54 109.91,67.24 110.62,67.94 117.09,67.94 118.75,69.6 J2.4
D37
  Top 0.254: U6.53 110.41,67.1 110.74,67.44 118.24,67.44 121.16,70.48 121.16,70.87 J2.2
D44  (via drill 0.38)
  Top 0.254: U6.40 111.52,59.17 v111.12,59.56 | R36.1 v145.54,51.82
  Bottom 0.254: v145.54,51.82 145.03,51.82 138.94,57.91 123.95,57.91 122.3,59.56 v111.12,59.56
D45  (via drill 0.38)
  Top 0.254: U6.39 111.39,58.67 v110.74,58.67 | R37.1 v140.97,51.82
  Bottom 0.254: v110.74,58.67 111.25,58.67 112.78,58.67 122.05,58.67 123.83,56.9 134.62,56.9 139.7,51.82 v140.97,51.82
D46  (via drill 0.38)
  Top 0.254: U6.38 111.76,58.17 v111.38,57.78 | R38.1 v136.53,51.69
  Bottom 0.254: v111.38,57.78 112.01,57.78 112.14,57.66 121.92,57.66 123.7,55.88 131.57,55.88 135.76,51.69 v136.53,51.69
D49  (via drill 0.38)
  Top 0.254: R19.1 115.19,11.56 116.97,13.34 116.97,24.13 115.06,26.04 v115.06,47.88 | U6.35 110.39,56.67 109.22,55.5 v109.22,53.59
  Bottom 0.254: v109.22,53.59 110.49,53.59 114.94,49.15 v115.06,47.88
D50/SPI_MISO  (via drill 0.38)
  Top 0.254: U6.22 109.91,49.35 111.38,47.88 111.38,46.78 U7.14 111.34,45.13 v111.38,45.09
  Bottom 0.254: v111.38,45.09 111.38,40.13 115.57,35.94 115.57,23.88 120.27,19.05 120.27,16 J13.1
D51/SPI_MOSI  (via drill 0.38)
  Top 0.254: U6.21 109.41,49.09 110.69,47.81 U7.15 110.69,44.39 v112.27,42.93
  Bottom 0.254: v112.27,42.93 112.27,40.89 116.33,36.96 116.33,26.42 124.08,18.54 J13.4
D52/SPI_SCK  (via drill 0.38)
  Top 0.254: U6.20 108.91,48.82 110.04,47.7 U7.16 110.04,45.4 v109.73,45.09
  Bottom 0.254: v109.73,45.09 109.73,40.77 114.81,35.69 114.81,23.5 119.63,18.67 119.63,13.84 120.65,12.83 122.17,12.83 J13.3
D53/SPI_SS
  Top 0.254: U6.19 108.41,48.56 109.35,47.62 109.35,46.78 U7.17
ESC1_PWR  (via drill 0.6)
  Top 0.254: R59.2 58.55,42.77 58.55,41.27 59.56,40.26 U9.5
  Top 1.27: R59.2 56.13,42.8
  Top 2.54: v46.74,42.8 56.13,42.8
  Bottom 2.54: 17.35,74.04 J14.1
  Bottom 3.048: v46.74,42.8 21.46,73.91 17.35,74.04 | v53.21,42.8 v51.69,42.8 v50.04,42.8 v48.39,42.8 v46.74,42.8 | 46.86,42.93 v46.74,42.8
ESC_1A
  Top 1.676: J5.1 8.69,68 10.67,69.98 17.25,69.98 J14.2
ESC_1B
  Top 1.676: J5.2 10.62,65.23 10.67,65.28 11.18,65.28 11.94,66.04 J14.3
ESC_1C
  Top 1.676: J5.3 11.94,62.48 12.32,62.1 17.25,62.1 J14.4
ESC_2A
  Top 1.676: J5.8 10.39,48.67 10.54,48.51 10.79,48.51 15.37,43.94 17.25,43.94 J15.2
ESC_2B
  Top 1.676: J5.9 9.58,45.92 15.49,40.01 J15.3
ESC_2C
  Top 1.676: J5.10 9.3,42.9 15.37,35.81 17.25,36.07 J15.4
ESC_3A
  Bottom 1.676: J5.11 8.91,40.23 11.3,38.99 13.21,29.59 13.08,24.38 12.7,24.13 12.7,19.81 14.61,18.03 17.17,18.03 J16.2
ESC_3B
  Top 1.676: J5.12 9.98,37.64 12.32,35.31 12.32,17.4 15.88,13.84 17.14,13.84 J16.3
ESC_3C
  Bottom 1.676: J5.13 8.69,34.87 11.05,29.46 11.05,25.65 10.41,25.02 10.41,15.11 15.75,10.03 17.25,10.03 J16.4
ESC_POWER
  Top 0.254: U10.4 60.47,33.03 61.85,34.8 61.85,35.46 R60.1 | U11.4 61.99,25.41 61.98,26.29 61.98,27.2 R61.1 | R59.1 61.34,42.77 61.34,41.53 60.2,40.39 60.2,39.88 U9.4
  Top 1.016: Q3.5 64.26,44.58 64.14,44.45 | Q3.6 64.14,43.31 | Q3.7 64.26,42.04 64.14,42.16 | 64.14,40.89 64.26,40.77 Q3.8
  Top 1.676: R61.1 63.5,27.3 | 64.14,40.89 64.14,42.16 64.14,42.8 | 64.14,42.8 64.14,43.31 | R59.1 64.14,42.8 | R60.1 63.88,35.56 64.14,35.31
  Top 1.93: 63.5,27.3 64.14,27.94 64.14,35.31 64.14,40.89 | 64.14,43.31 64.14,44.45
ESC_PWR2
  Top 0.254: U10.5 59.05,35.41 R60.2
  Top 1.27: 56.26,35.56 R60.2
  Top 1.676: J15.1 17.35,48.01
  Top 3.048: 56.26,35.56 36.7,35.56 24.26,48.01 17.35,48.01
ESC_PWR3
  Top 0.254: U11.5 61.34,25.53 59.05,26.42 59.05,27.28 R61.2
  Top 1.27: 56.64,27.3 R61.2
  Top 3.048: J16.1 28.88,21.89 34.29,27.3 56.64,27.3
FUSED_VBAT
  Top 0.254: R14.2 140.97,17.44 140.97,18.67 140.27,19.36 C10.1 139.19,19.3 | 139.32,19.43 139.19,19.3 | 139.32,19.3 139.19,19.18 139.19,19.3
  Top 0.305: 140.21,22.23 140.59,22.23 U4.1
  Top 1.016: 139.19,19.43 C10.1 139.19,22.23 | 139.19,22.23 137.62,22.23 | 137.62,22.23 F1.2 137.98,24.88 C8.1 | C9.1 136.91,21.52 137.62,22.23 | 139.19,22.23 140.21,22.23
GND  (via drill 0.38, 0.6)
  Top 0.254: v94.49,39.62 R7.2 | v62.23,33.78 C32.2 | U11.2 U11.1 60.28,22.69 v59.94,22.1 | v58.42,29.21 58.42,30.23 U10.1 U10.2 | v62.74,41.4 62.61,41.4 62.1,40.89 C31.2 | v137.92,6.48 OC1.3 | v124.71,29.72 125.09,29.34 125.98,29.34 U3.1 U3.2 | v127.89,22.99 127.38,23.5 C7.2 | v96.27,2.79 C29.2 | U7.11 v113.29,48.38 v113.28,48.39 | v119.51,50.55 C18.2 | v115.57,56.26 115.78,56.05 C20.2 C19.2 | v111.76,55.18 113.39,55.18 U6.32 | U1.2 U1.1 74.58,54.86 75.44,54.86 75.95,55.37 v76.07,55.37 76.07,56.39 75.69,56.77 C3.2 | v85.47,67.94 82.8,67.94 81.92,67.06 SENS1.PAD | v88.39,65.91 88.52,65.91 89.66,64.77 SENS2.3 | C24.2 86.49,64.39 85.72,65.15 85.72,65.79 86.11,66.17 88.14,66.17 v88.39,65.91 | C23.2 91.99,65.24 91.31,65.91 v88.39,65.91 | C26.2 88.3,58.93 87.38,58.93 86.49,58.04 v86.49,56.64 86.49,56.52 87.12,55.88 87.12,54.7 C25.2 | U6.62 105.91,65.02 v105.03,64.14 | v134.3,51.82 134.3,53.06 R43.1 | v138.24,51.69 138.24,51.75 138.68,52.2 R42.1 | v142.81,51.82 142.81,52.01 143.13,52.32 R41.1 | v147.64,51.82 147.64,51.88 147.7,51.94 R40.1 | v147,56.26 Q4.2 | v142.81,56.26 Q5.2 | v138.62,56.39 Q6.2 | v134.05,56.13 134.11,56.13 134.49,56.52 134.49,57.76 Q7.2 | v148.21,21.21 C11.2 | v148.21,24.51 R17.1 | U4.7 v142.1,25.09 v142.11,25.08 | v142.11,24.19 142.05,24.19 U4.11 | U6.11 104.41,51.8 v103.63,52.58 | C17.2 103.5,45.21 104.01,44.7 v104.65,44.7 105.41,44.7 105.79,45.09 105.79,45.82 C30.2 | C22.2 102.27,69.05 v101.35,69.98 | C6.2 97.24,48.17 J9.3 | R11.2 v89.15,46.1 91.65,43.6 Q2.2 | C27.2 89.92,51.56 v90.3,51.94 91.06,51.94 91.31,52.2 C21.2 | v104.65,42.16 104.14,41.66 104.14,40.68 C28.2 | J12.2 131.32,17.46 C35.2
  Top 0.254: v59.94,22.1 59.82,22.1 | SENS1.1 v80.64,55.12 | U2.2 U2.1 74.96,64.52 v75.82,64.52 75.02,65.32 C4.2 | LED6.C 98.42,2.41 | LED7.C 101.85,2.41 | v53.47,38.35 54.7,38.35 C36.2 | v53.85,32.89 55.33,32.89 C37.2 | v58.04,37.34 58.93,37.34 | 58.93,37.34 59.56,37.34 U9.2 | U9.1 58.91,37.35 58.93,37.34 | C38.2 v56.39,21.46 | v59.94,22.1 59.94,20.74 C33.2 | R67.1 85.26,4.28 v85.22,4.32
  Top 0.305: U6.81 98.73,61.67 v99.57,60.83 | U4.5 144,22.24 | U6.99 98.64,52.67 v99.25,53.15 | 94.74,8.95 U8.4 | v96.27,2.79 96.27,4.95 | 96.27,4.95 96.27,6.22 U8.2 | 96.27,4.95 U8.1
  Top 0.406: 108.58,2.41 v106.93,2.41 101.85,2.41 98.42,2.41 | 108.58,2.41 111.89,2.41 | 111.89,2.41 115.19,2.41 LED2.C | LED5.C 111.89,2.41 | LED1.C 108.58,2.41 | 144,22.24 v144.02,22.23 | J5.17 5.89,58.34 7.24,59.69 7.24,69.6 | v94.74,10.16 94.74,8.95
  Top 0.61: 7.24,69.6 11.05,73.41 11.05,75.31 12.06,76.33 21.97,76.33 22.48,75.95 22.48,73.79 24.89,72.01 30.86,72.01 35.18,77.22 121.79,77.34 J1.15 | v129.92,42.42 C34.-
  Top 0.813: 126.93,45.59 C16.2 | v57.53,46.1 C2.2 | v57.4,60.96 C1.2
  Top 1.016: C9.2 v136.91,15.75 | C10.2 v139.19,15.75 | v125.6,45.59 126.93,45.59 | v125.6,43.69 126.55,43.69 C15.2 | v117.22,40.51 v117.22,41.66 119.05,41.66 U5.1 | C14.2 v147.96,42.16 | C8.2 v134.49,26.54 | v82.93,49.15 v84.2,49.15
  Top 1.27: R15.1 148.72,30.23 148.84,30.48 v148.84,32.51 147.96,32.51 | v146.56,32.51 147.96,32.51 | 147.96,32.51 C13.2
  Top 1.676: D3.A 82.64,48.85 v82.93,49.15
  other vias: 141.1,25.08 141.1,24.19 147.7,32.51
  pour Route2 (isolate 0.254): 0,80.01 149.86,80.01 149.86,80.14 149.99,80.14 149.99,0 0,0
N$1  (via drill 0.38)
  Top 0.254: OC1.1 v124.21,9.02 | v85.72,12.06 85.72,18.41 84.45,19.68 83.73,19.68 R3.1
  Bottom 0.254: v124.21,9.02 87.63,9.27 85.72,11.68 v85.72,12.06
N$2  (via drill 0.38)
  Top 0.254: 84.45,43.69 84.45,42.93 85.09,42.29 R9.2 85.72,42.33 85.72,43.18 86.61,44.07 R6.1 | 84.45,43.69 D5.A | Q3.4 70.87,44.58 v71.88,45.59 | v83.57,43.94 84.2,43.94 84.45,43.69
  Bottom 0.254: v71.88,45.59 82.42,45.59 83.19,44.83 83.19,44.07 v83.57,43.94
N$3  (via drill 0.38)
  Top 0.254: Q2.3 R9.1 87.46,42.76 87.88,43.31 87.88,47.24 84.71,50.42 83.06,50.42 82.55,50.93 v82.55,53.47
  Bottom 0.254: J17.1 72.9,63.37 79.76,56.52 81.28,56.52 82.55,55.24 v82.55,53.47
N$4
  Top 0.254: R1.1 72.49,60.68 73.28,61.47 73.28,62.1 U2.4
  Top 1.27: 69.56,59.31 D1.4
  Top 1.676: R1.1 69.56,59.31
N$5
  Top 0.305: LED2.A R19.2
N$6
  Top 0.254: Q2.1 91.71,41.4 92.71,41.4 93.69,42.38 R7.1 94.49,42.55 95.38,43.43 R5.1
N$7  (via drill 0.6)
  Top 0.254: R4.2 D4.C 122.98,27.52 118.36,30.99 118.36,33.91 118.87,34.42 | U2.5 73.91,61.72 75.31,60.33 75.31,59.33 R1.2 | U1.5 73.91,52.22 R2.2 | R6.2 D5.C 84.41,46.48 79.88,46.48 78.23,48.13 | v77.98,48.13 78.11,48.01
  Top 0.61: Q1.2 v118.62,35.69 | v118.62,34.42 118.49,34.42
  Top 0.813: Q1.1 v118.62,36.96 | Q1.2 118.75,35.69 118.62,35.81 | 118.87,34.42 v118.62,34.42 Q1.3
  Top 1.016: v118.62,36.96 118.62,35.81 118.62,35.56 | 118.62,35.56 v118.62,34.42 | 118.75,35.69 118.62,35.56 | Q3.3 73.41,43.31 73.53,43.18 | Q3.2 73.41,42.04 73.53,41.91 | Q3.1 73.53,40.77
  Top 1.676: R2.2 77.98,50.67 78.11,48.01 78.23,48.13 | R1.2 75.69,59.31 78.11,56.9 | D3.C 78.15,53.25 78.11,53.21
  Top 1.93: 78.11,56.9 78.11,53.21 78.11,48.01 | v77.98,48.13 v76.71,48.13 v75.44,48.13 75.44,48.01 73.53,46.1 73.53,43.18 73.53,41.91 73.53,40.77
  Route15 1.676: v118.62,34.42 v118.62,36.96 93.09,36.96 83.06,46.99 79.12,46.99 v77.98,48.13 v76.71,48.13 v75.44,48.13 63.88,48.13 60.2,51.82 J11.1
N$8
  Top 0.254: Q1.4 120.34,30.54 125.09,26.92 125.09,26.37 D4.A 125.18,24.25 R4.1 125.48,23.75 126.75,22.48 126.75,20.74 R8.2
N$9
  Top 0.254: LED6.A R63.1
N$10
  Top 0.254: 80.01,22.86 82.8,22.86 83.69,21.97 R3.2
  Top 0.305: FB1.2 75.44,22.86 | 75.44,22.86 80.01,22.86 | C5.1 75.44,22.86
N$11
  Top 0.305: LED1.A R18.2
N$12
  Top 0.254: SENS1.2 81.92,55.5 83.82,53.53 R45.1
N$13
  Top 0.254: SENS2.2 90.61,59.46 R44.1
N$14
  Top 0.254: Q4.1 145.1,56.7 145.54,55.63 R36.2 R40.2
N$15
  Top 0.254: U6.33 114.01,55.67 114.81,55.63 115.7,54.74 115.7,53.47 116.33,52.83 117.06,52.83 C19.1 118.28,52.87 118.62,53.21 120.09,53.21 X1.2
N$16
  Top 0.254: R17.2 R16.1 145.09,27.04 U4.6
N$17
  Top 0.254: Q5.1 140.91,54.89 R37.2 R41.2
N$18
  Top 0.254: Q6.1 136.72,56.71 136.53,56.52 R38.2 R42.2
N$19
  Top 0.254: Q7.1 132.53,56.84 132.08,55.75 R39.2 R43.2
N$20
  Top 0.305: D6.A 142.53,28.87 141.6,27.94 U4.8
  Top 1.016: D6.A 144.9,29.84 R15.2
N$21
  Top 0.406: J5.24 5.82,38.96 2.92,36.96 2.92,24.77 5.21,22.48 5.21,16 TP24.1
N$22
  Top 0.406: J5.20 5.82,50.01 1.02,45.97 1.02,23.24 TP20.1
N$23
  Top 0.254: U4.4 142.1,21.6 142.49,21.21 C11.1
N$24
  Top 0.305: U4.10 139.84,27.04 138.68,28.19 135,28.19 134.24,28.96 134.24,29.5 C12.1
N$25
  Top 0.254: 141.1,28.31 140.84,28.19
  Top 0.305: U4.9 141.1,28.31
  Top 0.813: D6.C 138.56,29.84 140.46,28.19 140.84,28.19
  Top 1.016: C12.2 137.67,29.59 137.88,29.59 D6.C
  Top 1.27: L1.P$1 133.6,33.66 137.67,29.59
N$26
  Top 0.813: J7.1 J21.P8 J21.P5 J21.P2 J20.P8 J20.P5 J20.P2
N$27
  Top 0.254: U4.2 141.1,20.57 142.75,18.92 142.75,17.74 R14.1
N$28
  Top 0.254: U4.3 141.6,20.83 143.51,18.92 144.82,18.92 R13.1
N$29
  Bottom 0.406: J5.21 5.77,47.3 1.4,42.93 1.4,27.43 TP21.1
N$30
  Top 0.406: J5.22 5.79,44.53 1.91,41.02 2.03,24.51 4.45,22.1 4.45,19.18 TP22.1
N$31
  Bottom 0.406: J5.23 5.82,41.76 2.41,38.35 2.41,27.69 7.24,22.86 8.38,22.86 9.02,22.23 9.02,18.92 TP23.1
N$32
  Top 0.406: J5.25 5.77,36.25 3.94,34.42 3.94,25.15 5.97,23.11 5.97,15.24 TP25.1
N$33
  cutout Route2: 5.84,57.15 5.08,57.15 4.45,57.78 4.45,58.8 5.08,59.44 6.35,59.44 6.99,58.8 6.99,57.66 6.35,57.15
N$34
  Top 0.254: U7.10 113.29,26.42 113.28,26.41 113.28,23.75 110.78,21.25 R47.1 R48.1
N$35
  Top 0.254: U6.34 114.33,56.17 115.95,57.78 117.06,57.78 C20.1 117.89,57.75 118.75,56.9 120.07,56.9 X1.1
N$36
  Top 0.254: R23.2 LED5.A
N$37
  Top 0.254: R49.1 57.57,38.39 58.04,38.86 58.04,39.62 58.29,39.88 58.9,39.88 U9.6
N$38
  Top 0.254: R50.1 58.55,32.85 U10.6
N$39
  Top 0.254: R52.1 R67.2 87,2.83 87,5.65 87.57,6.22 U8.7
N$40
  Top 0.254: U8.3 96.65,7.49 96.69,7.53 R51.1
N$41
  Top 0.254: R2.1 72.62,51.54 73.28,52.2 73.28,52.83 U1.4
  Top 1.27: 69.98,48.77 69.45,48.93 D2.4
  Top 1.676: R2.1 71.19,50.67 69.45,48.93
N$42
  Top 0.254: LED4.C R22.1
N$43
  Top 0.254: LED3.C R21.1
N$44
  Top 0.254: U7.9 112.64,30.86 112.65,30.85 112.65,25.53 110.49,23.37 105.79,23.37 105.16,22.73 105.16,20.83 105.12,20.79 R62.1
N$45
  Top 0.254: OC1.4 136.22,12.62 134.87,13.97 J12.1 133.86,17.46 C35.1 133.6,17.85 133.6,19.68 132.59,20.7 R8.1
N$46  (via drill 0.38)
  Top 0.254: R63.2 99.53,8.6 100.58,9.65 v100.58,11.43 | v94.61,32 91.31,32 84.33,38.99 81.15,38.99 J18.3
  Bottom 0.254: v100.58,11.43 100.46,11.43 98.42,13.46 98.42,27.69 v94.61,32
N$47
  Top 0.254: R66.1 59.22,22.64 59.56,22.99 59.56,24.38 59.94,24.77 60.67,24.77 U11.6
N$48  (via drill 0.38)
  Top 0.254: R64.2 v101.85,11.43 | v95.38,32.64 91.82,32.64 81.92,42.55 80.14,42.55 J18.4
  Bottom 0.254: v101.85,11.43 101.85,12.06 100.97,12.83 100.97,27.05 v95.38,32.64
N$49
  Top 0.254: LED7.A R64.1
N$50  (via drill 0.38)
  Top 0.254: R65.2 v105.28,11.43 | v97.92,31.24 90.81,31.24 83.95,38.1 78.99,38.1 77.47,39.62 77.47,42.67 J18.2
  Bottom 0.254: v105.28,11.43 104.52,11.43 103.5,12.45 103.5,25.65 v97.92,31.24
N$51
  Top 0.254: LED8.C R65.1
PWM_1+
  Top 0.406: 148.46,48.9 R26.2
  Top 0.61: J1.1 146.18,70.74 D7.C 148.29,67.35 148.84,66.8 148.84,49.28 148.46,48.9 | R24.2 R25.2 R26.2
PWM_1-
  Top 0.406: 146.05,62.82 D7.A 145.88,62.99
  Top 0.61: Q4.3 146.05,62.82 | J1.2 144.4,69.98 144.4,65.91 145.88,64.43 145.88,62.99
PWM_2+
  Top 0.61: J1.3 142.11,72.26 142.11,69.6 D8.C 142.62,65.91 144.4,64.14 144.4,60.58 143.89,60.07 143.89,56.77 144.27,55.75 144.27,50.67 143.51,49.78 R29.2 R28.2 R27.2
PWM_2-
  Top 0.406: 142.33,62.87 D8.A
  Top 0.61: J1.4 140.97,69.34 140.97,66.04 142.33,64.68 142.33,62.87 | Q5.3 141.86,60.96 142.62,61.72 D8.A
PWM_3+
  Top 0.406: 139.06,65.79 139.19,65.79
  Top 0.61: J1.5 139.57,72.26 139.57,68.96 139.06,68.33 D9.C 139.06,65.79 | 139.19,65.79 140.97,64.01 140.97,61.72 139.83,60.45 139.83,50.29 139.06,49.53 139.06,48.93 R32.2 R31.2 R30.2
PWM_3-
  Top 0.406: 139.23,62.36 D9.A
  Top 0.61: J1.6 138.3,69.6 137.41,68.71 137.41,66.04 139.23,64.22 139.23,62.36 137.67,60.79 Q6.3
PWM_4+
  Top 0.406: 135.64,67.35 D10.C
  Top 0.61: J1.7 137.03,72.26 137.03,69.85 135.64,68.45 135.64,67.35 | D10.C 135.51,66.04 137.29,64.26 137.29,61.85 135.64,60.2 135.64,56.52 135.38,55.75 135.38,50.08 R35.2 R34.2 R33.2
PWM_4-
  Top 0.406: 133.56,62.82 133.48,62.74
  Top 0.61: Q7.3 133.48,62.74 133.48,68.71 J1.8 | D10.A 133.56,62.82
RESET_N  (via drill 0.38)
  Top 0.254: v112.39,43.94 112.39,45.21 111.99,45.62 U7.13 112.01,46.77 112.01,53.98 112.2,54.17 U6.30 | R20.2 126.45,14.57 J13.5
  Bottom 0.254: v112.39,43.94 113.54,42.8 113.54,41.4 117.09,37.97 117.09,27.3 125.22,19.43 125.22,16.13 J13.5
TETHER_A
  Top 0.305: J10.1 68.89,28.4 71.5,25.4 FB1.1
  Route15 0.406: J10.1 105.21,28.4 J19.1 J19.2
  Bottom 0.406: J5.18 24.94,55.58 56.13,24.38 61.98,24.38 65.91,28.32 67.36,28.32 J10.1
TETHER_B  (via drill 0.38)
  Top 0.254: 71.29,19.49 69.6,22.35 68.96,23.37 67.49,23.37 J10.3 | C5.2 76.67,19.47 81.92,19.49 83.19,18.03 v83.19,12.06 | OC1.2 v124.97,5.21
  Top 0.305: 71.29,19.49 C5.2
  Route15 0.406: J19.6 J19.5 100.84,27.69 72.52,27.69 68.2,23.37 67.49,23.37 J10.3
  Bottom 0.254: v124.97,5.21 85.22,5.46 85.22,5.59 84.2,6.6 84.2,10.79 v83.19,12.06
  Bottom 0.406: J5.19 26.19,52.81 55.44,23.24 67.36,23.24 J10.3
V_BAT  (via drill 0.38, 0.6)
  Top 0.254: U3.5 128.52,28.7 v129.16,29.34 | v129.16,27.43 129.67,27.94 131.13,27.94 R12.2
  Top 0.61: R26.1 v144.91,48.9 | R29.1 v140.4,48.9 | R32.1 v136.02,48.9 | R35.1 v131.51,48.9
  Top 1.016: F1.1 131.19,23.42 R12.2 131.25,27.94 v133.1,27.94 v133.1,26.73
  Bottom 0.254: v129.16,29.34 v129.16,27.43
  Bottom 1.016: v144.91,48.9 v140.4,48.9 v136.02,48.9 v131.51,48.9 131.44,48.9 128.02,45.47 128.02,41.53 131.7,37.85 131.7,29.21 v133.1,27.94 v133.1,26.73

## Text on the board
tPlace: OpenROV / Controller / Board / Rev 2.6 | GND GND GND GND GND GND +3.3 +5v | +5V GND D5~ D4~ D3~ D2~ GND +5V | +5V GND D19 D18 D15 D14 GND +5V | P1+ P2+ P3+ P4+ +3.3 SCL SDA GND | A15 A14 A13 A12 A11 A10 A9 AREF | D29 D28 D27 D26 D25 D24 D23 D22 | D37 D36 D35 D34 D33 D32 D31 D30 | P1- P2- P3- P4- +5v SCL SDA GND | GND | ESC Pwr / Switch | ESC 1 | +V | Aux Power / Connection | VBAT | +5V | 3.3V | ESC 2 | ICSP / Header | Pwr / Switch | ESC 3 | +V | Sig | This work is released under the Creative Commons / Attribution-NonCommercial-Share Alike 3.0 / Unported License. All derivative works are to / be attributed to OpenROV | BEC | GND | Servo / Outputs | GND | GND | GND | D6 D7 D8 | D9 D10 D11 | Ext Servo Pwr | TPWR HP ETH | PWR D13 D49 BTX BRX